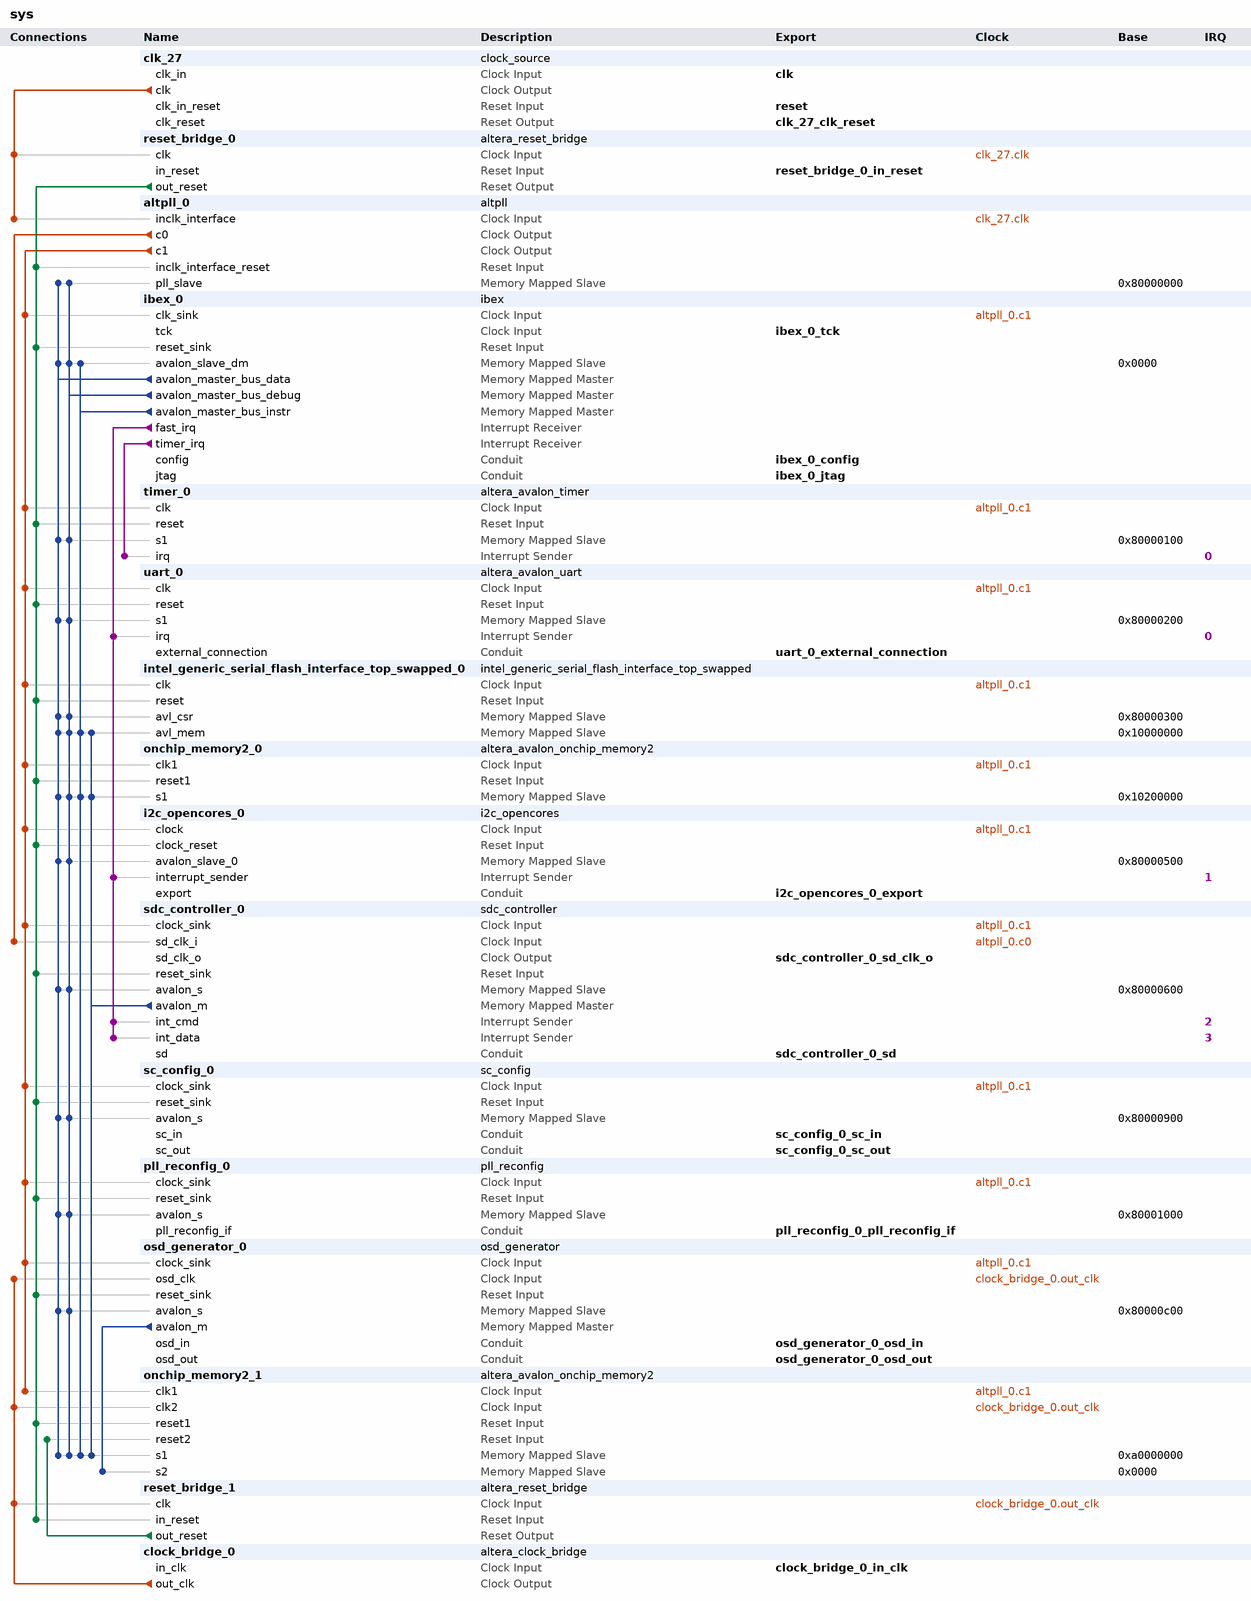
[diagram p0: system contents]
# Platform Designer (Qsys) system sys, Cyclone IV E EP4CE15E22C8
# Parameters at their usual value, and those the tool derives, are not listed.
package require -exact qsys 24.1
create_system sys
set_project_property DEVICE_FAMILY {Cyclone IV E}
set_project_property DEVICE EP4CE15E22C8

add_instance clk_27 clock_source 24.1
set_instance_parameter_value clk_27 clockFrequency 27000000

add_instance reset_bridge_0 altera_reset_bridge 24.1
set_instance_parameter_value reset_bridge_0 ACTIVE_LOW_RESET 1
set_instance_parameter_value reset_bridge_0 SYNCHRONOUS_EDGES deassert

add_instance altpll_0 altpll 24.1
set_instance_parameter_value altpll_0 CLK0_DIVIDE_BY 1
set_instance_parameter_value altpll_0 CLK0_MULTIPLY_BY 4
set_instance_parameter_value altpll_0 CLK1_DIVIDE_BY 1
set_instance_parameter_value altpll_0 CLK1_DUTY_CYCLE 50
set_instance_parameter_value altpll_0 CLK1_MULTIPLY_BY 2
set_instance_parameter_value altpll_0 CLK1_PHASE_SHIFT 0
set_instance_parameter_value altpll_0 INCLK0_INPUT_FREQUENCY 37037
set_instance_parameter_value altpll_0 PORT_ARESET PORT_UNUSED
set_instance_parameter_value altpll_0 PORT_LOCKED PORT_UNUSED
set_instance_parameter_value altpll_0 PORT_clk1 PORT_USED
set_instance_parameter_value altpll_0 PORT_clk2 PORT_UNUSED
set_instance_parameter_value altpll_0 PORT_clk3 PORT_UNUSED

add_instance ibex_0 ibex 1.0
set_instance_parameter_value ibex_0 IBEX_RV32E true

add_instance timer_0 altera_avalon_timer 24.1
set_instance_parameter_value timer_0 alwaysRun true
set_instance_parameter_value timer_0 fixedPeriod true
set_instance_parameter_value timer_0 period 5400
set_instance_parameter_value timer_0 periodUnits CLOCKS
set_instance_parameter_value timer_0 snapshot false

add_instance uart_0 altera_avalon_uart 24.1
set_instance_parameter_value uart_0 baud 115200
set_instance_parameter_value uart_0 dataBits 8
set_instance_parameter_value uart_0 fixedBaud true
set_instance_parameter_value uart_0 parity NONE
set_instance_parameter_value uart_0 stopBits 1

add_instance intel_generic_serial_flash_interface_top_swapped_0 intel_generic_serial_flash_interface_top_swapped 24.1
set_instance_parameter_value intel_generic_serial_flash_interface_top_swapped_0 CHIP_SELECT_BYPASS false
set_instance_parameter_value intel_generic_serial_flash_interface_top_swapped_0 CHIP_SELS 1
set_instance_parameter_value intel_generic_serial_flash_interface_top_swapped_0 DEBUG_OPTION 0
set_instance_parameter_value intel_generic_serial_flash_interface_top_swapped_0 DEFAULT_VALUE_REG_0 1
set_instance_parameter_value intel_generic_serial_flash_interface_top_swapped_0 DEFAULT_VALUE_REG_1 1
set_instance_parameter_value intel_generic_serial_flash_interface_top_swapped_0 DEFAULT_VALUE_REG_2 0
set_instance_parameter_value intel_generic_serial_flash_interface_top_swapped_0 DEFAULT_VALUE_REG_3 0
set_instance_parameter_value intel_generic_serial_flash_interface_top_swapped_0 DEFAULT_VALUE_REG_4 0
set_instance_parameter_value intel_generic_serial_flash_interface_top_swapped_0 DEFAULT_VALUE_REG_5 3
set_instance_parameter_value intel_generic_serial_flash_interface_top_swapped_0 DEFAULT_VALUE_REG_6 1282
set_instance_parameter_value intel_generic_serial_flash_interface_top_swapped_0 DEFAULT_VALUE_REG_7 6149
set_instance_parameter_value intel_generic_serial_flash_interface_top_swapped_0 DEVICE_DENSITY 16
set_instance_parameter_value intel_generic_serial_flash_interface_top_swapped_0 ENABLE_SIM_MODEL false
set_instance_parameter_value intel_generic_serial_flash_interface_top_swapped_0 PIPE_CMD_GEN_CMD 0
set_instance_parameter_value intel_generic_serial_flash_interface_top_swapped_0 PIPE_CSR 0
set_instance_parameter_value intel_generic_serial_flash_interface_top_swapped_0 PIPE_MUX_CMD 0
set_instance_parameter_value intel_generic_serial_flash_interface_top_swapped_0 PIPE_XIP 0
set_instance_parameter_value intel_generic_serial_flash_interface_top_swapped_0 USE_CHIP_SEL_FROM_CSR 1
set_instance_parameter_value intel_generic_serial_flash_interface_top_swapped_0 gui_use_asmiblock false
set_instance_parameter_value intel_generic_serial_flash_interface_top_swapped_0 gui_use_csr_byteenable false
set_instance_parameter_value intel_generic_serial_flash_interface_top_swapped_0 gui_use_gpio false

add_instance onchip_memory2_0 altera_avalon_onchip_memory2 24.1
set_instance_parameter_value onchip_memory2_0 dataWidth 32
set_instance_parameter_value onchip_memory2_0 dualPort false
set_instance_parameter_value onchip_memory2_0 initMemContent false
set_instance_parameter_value onchip_memory2_0 initializationFileName onchip_mem.hex
set_instance_parameter_value onchip_memory2_0 memorySize 16384
set_instance_parameter_value onchip_memory2_0 readDuringWriteMode OLD_DATA
set_instance_parameter_value onchip_memory2_0 singleClockOperation true

add_instance i2c_opencores_0 i2c_opencores 17.1
set_instance_parameter_value i2c_opencores_0 dedicated_spi 0

add_instance sdc_controller_0 sdc_controller 1.0

add_instance sc_config_0 sc_config 1.0

add_instance pll_reconfig_0 pll_reconfig 1.0

add_instance osd_generator_0 osd_generator 1.0

add_instance onchip_memory2_1 altera_avalon_onchip_memory2 24.1
set_instance_parameter_value onchip_memory2_1 dataWidth 32
set_instance_parameter_value onchip_memory2_1 dualPort true
set_instance_parameter_value onchip_memory2_1 initMemContent false
set_instance_parameter_value onchip_memory2_1 initializationFileName onchip_mem.hex
set_instance_parameter_value onchip_memory2_1 memorySize 24576

add_instance reset_bridge_1 altera_reset_bridge 24.1
set_instance_parameter_value reset_bridge_1 ACTIVE_LOW_RESET 0
set_instance_parameter_value reset_bridge_1 SYNCHRONOUS_EDGES deassert

add_instance clock_bridge_0 altera_clock_bridge 24.1
set_instance_parameter_value clock_bridge_0 DERIVED_CLOCK_RATE 0
set_instance_parameter_value clock_bridge_0 EXPLICIT_CLOCK_RATE 0

# connections
add_connection altpll_0.c0 sdc_controller_0.sd_clk_i clock
add_connection altpll_0.c1 i2c_opencores_0.clock clock
add_connection altpll_0.c1 ibex_0.clk_sink clock
add_connection altpll_0.c1 intel_generic_serial_flash_interface_top_swapped_0.clk clock
add_connection altpll_0.c1 onchip_memory2_0.clk1 clock
add_connection altpll_0.c1 onchip_memory2_1.clk1 clock
add_connection altpll_0.c1 osd_generator_0.clock_sink clock
add_connection altpll_0.c1 pll_reconfig_0.clock_sink clock
add_connection altpll_0.c1 sc_config_0.clock_sink clock
add_connection altpll_0.c1 sdc_controller_0.clock_sink clock
add_connection altpll_0.c1 timer_0.clk clock
add_connection altpll_0.c1 uart_0.clk clock
add_connection clk_27.clk altpll_0.inclk_interface clock
add_connection clk_27.clk reset_bridge_0.clk clock
add_connection clock_bridge_0.out_clk onchip_memory2_1.clk2 clock
add_connection clock_bridge_0.out_clk osd_generator_0.osd_clk clock
add_connection clock_bridge_0.out_clk reset_bridge_1.clk clock
add_connection reset_bridge_0.out_reset altpll_0.inclk_interface_reset reset
add_connection reset_bridge_0.out_reset i2c_opencores_0.clock_reset reset
add_connection reset_bridge_0.out_reset ibex_0.reset_sink reset
add_connection reset_bridge_0.out_reset intel_generic_serial_flash_interface_top_swapped_0.reset reset
add_connection reset_bridge_0.out_reset onchip_memory2_0.reset1 reset
add_connection reset_bridge_0.out_reset onchip_memory2_1.reset1 reset
add_connection reset_bridge_0.out_reset osd_generator_0.reset_sink reset
add_connection reset_bridge_0.out_reset pll_reconfig_0.reset_sink reset
add_connection reset_bridge_0.out_reset reset_bridge_1.in_reset reset
add_connection reset_bridge_0.out_reset sc_config_0.reset_sink reset
add_connection reset_bridge_0.out_reset sdc_controller_0.reset_sink reset
add_connection reset_bridge_0.out_reset timer_0.reset reset
add_connection reset_bridge_0.out_reset uart_0.reset reset
add_connection reset_bridge_1.out_reset onchip_memory2_1.reset2 reset
add_connection ibex_0.avalon_master_bus_data altpll_0.pll_slave avalon
set_connection_parameter_value ibex_0.avalon_master_bus_data/altpll_0.pll_slave baseAddress 0x80000000
add_connection ibex_0.avalon_master_bus_data i2c_opencores_0.avalon_slave_0 avalon
set_connection_parameter_value ibex_0.avalon_master_bus_data/i2c_opencores_0.avalon_slave_0 baseAddress 0x80000500
add_connection ibex_0.avalon_master_bus_data ibex_0.avalon_slave_dm avalon
set_connection_parameter_value ibex_0.avalon_master_bus_data/ibex_0.avalon_slave_dm baseAddress 0x0000
add_connection ibex_0.avalon_master_bus_data intel_generic_serial_flash_interface_top_swapped_0.avl_csr avalon
set_connection_parameter_value ibex_0.avalon_master_bus_data/intel_generic_serial_flash_interface_top_swapped_0.avl_csr baseAddress 0x80000300
add_connection ibex_0.avalon_master_bus_data intel_generic_serial_flash_interface_top_swapped_0.avl_mem avalon
set_connection_parameter_value ibex_0.avalon_master_bus_data/intel_generic_serial_flash_interface_top_swapped_0.avl_mem baseAddress 0x10000000
add_connection ibex_0.avalon_master_bus_data onchip_memory2_0.s1 avalon
set_connection_parameter_value ibex_0.avalon_master_bus_data/onchip_memory2_0.s1 baseAddress 0x10200000
add_connection ibex_0.avalon_master_bus_data onchip_memory2_1.s1 avalon
set_connection_parameter_value ibex_0.avalon_master_bus_data/onchip_memory2_1.s1 baseAddress 0xa0000000
add_connection ibex_0.avalon_master_bus_data osd_generator_0.avalon_s avalon
set_connection_parameter_value ibex_0.avalon_master_bus_data/osd_generator_0.avalon_s baseAddress 0x80000c00
add_connection ibex_0.avalon_master_bus_data pll_reconfig_0.avalon_s avalon
set_connection_parameter_value ibex_0.avalon_master_bus_data/pll_reconfig_0.avalon_s baseAddress 0x80001000
add_connection ibex_0.avalon_master_bus_data sc_config_0.avalon_s avalon
set_connection_parameter_value ibex_0.avalon_master_bus_data/sc_config_0.avalon_s baseAddress 0x80000900
add_connection ibex_0.avalon_master_bus_data sdc_controller_0.avalon_s avalon
set_connection_parameter_value ibex_0.avalon_master_bus_data/sdc_controller_0.avalon_s baseAddress 0x80000600
add_connection ibex_0.avalon_master_bus_data timer_0.s1 avalon
set_connection_parameter_value ibex_0.avalon_master_bus_data/timer_0.s1 baseAddress 0x80000100
add_connection ibex_0.avalon_master_bus_data uart_0.s1 avalon
set_connection_parameter_value ibex_0.avalon_master_bus_data/uart_0.s1 baseAddress 0x80000200
add_connection ibex_0.avalon_master_bus_debug altpll_0.pll_slave avalon
set_connection_parameter_value ibex_0.avalon_master_bus_debug/altpll_0.pll_slave baseAddress 0x80000000
add_connection ibex_0.avalon_master_bus_debug i2c_opencores_0.avalon_slave_0 avalon
set_connection_parameter_value ibex_0.avalon_master_bus_debug/i2c_opencores_0.avalon_slave_0 baseAddress 0x80000500
add_connection ibex_0.avalon_master_bus_debug ibex_0.avalon_slave_dm avalon
set_connection_parameter_value ibex_0.avalon_master_bus_debug/ibex_0.avalon_slave_dm baseAddress 0x0000
add_connection ibex_0.avalon_master_bus_debug intel_generic_serial_flash_interface_top_swapped_0.avl_csr avalon
set_connection_parameter_value ibex_0.avalon_master_bus_debug/intel_generic_serial_flash_interface_top_swapped_0.avl_csr baseAddress 0x80000300
add_connection ibex_0.avalon_master_bus_debug intel_generic_serial_flash_interface_top_swapped_0.avl_mem avalon
set_connection_parameter_value ibex_0.avalon_master_bus_debug/intel_generic_serial_flash_interface_top_swapped_0.avl_mem baseAddress 0x10000000
add_connection ibex_0.avalon_master_bus_debug onchip_memory2_0.s1 avalon
set_connection_parameter_value ibex_0.avalon_master_bus_debug/onchip_memory2_0.s1 baseAddress 0x10200000
add_connection ibex_0.avalon_master_bus_debug onchip_memory2_1.s1 avalon
set_connection_parameter_value ibex_0.avalon_master_bus_debug/onchip_memory2_1.s1 baseAddress 0xa0000000
add_connection ibex_0.avalon_master_bus_debug osd_generator_0.avalon_s avalon
set_connection_parameter_value ibex_0.avalon_master_bus_debug/osd_generator_0.avalon_s baseAddress 0x80000c00
add_connection ibex_0.avalon_master_bus_debug pll_reconfig_0.avalon_s avalon
set_connection_parameter_value ibex_0.avalon_master_bus_debug/pll_reconfig_0.avalon_s baseAddress 0x80001000
add_connection ibex_0.avalon_master_bus_debug sc_config_0.avalon_s avalon
set_connection_parameter_value ibex_0.avalon_master_bus_debug/sc_config_0.avalon_s baseAddress 0x80000900
add_connection ibex_0.avalon_master_bus_debug sdc_controller_0.avalon_s avalon
set_connection_parameter_value ibex_0.avalon_master_bus_debug/sdc_controller_0.avalon_s baseAddress 0x80000600
add_connection ibex_0.avalon_master_bus_debug timer_0.s1 avalon
set_connection_parameter_value ibex_0.avalon_master_bus_debug/timer_0.s1 baseAddress 0x80000100
add_connection ibex_0.avalon_master_bus_debug uart_0.s1 avalon
set_connection_parameter_value ibex_0.avalon_master_bus_debug/uart_0.s1 baseAddress 0x80000200
add_connection ibex_0.avalon_master_bus_instr ibex_0.avalon_slave_dm avalon
set_connection_parameter_value ibex_0.avalon_master_bus_instr/ibex_0.avalon_slave_dm baseAddress 0x0000
add_connection ibex_0.avalon_master_bus_instr intel_generic_serial_flash_interface_top_swapped_0.avl_mem avalon
set_connection_parameter_value ibex_0.avalon_master_bus_instr/intel_generic_serial_flash_interface_top_swapped_0.avl_mem baseAddress 0x10000000
add_connection ibex_0.avalon_master_bus_instr onchip_memory2_0.s1 avalon
set_connection_parameter_value ibex_0.avalon_master_bus_instr/onchip_memory2_0.s1 baseAddress 0x10200000
add_connection ibex_0.avalon_master_bus_instr onchip_memory2_1.s1 avalon
set_connection_parameter_value ibex_0.avalon_master_bus_instr/onchip_memory2_1.s1 baseAddress 0xa0000000
add_connection osd_generator_0.avalon_m onchip_memory2_1.s2 avalon
set_connection_parameter_value osd_generator_0.avalon_m/onchip_memory2_1.s2 baseAddress 0x0000
add_connection sdc_controller_0.avalon_m intel_generic_serial_flash_interface_top_swapped_0.avl_mem avalon
set_connection_parameter_value sdc_controller_0.avalon_m/intel_generic_serial_flash_interface_top_swapped_0.avl_mem baseAddress 0x10000000
add_connection sdc_controller_0.avalon_m onchip_memory2_0.s1 avalon
set_connection_parameter_value sdc_controller_0.avalon_m/onchip_memory2_0.s1 baseAddress 0x10200000
add_connection sdc_controller_0.avalon_m onchip_memory2_1.s1 avalon
set_connection_parameter_value sdc_controller_0.avalon_m/onchip_memory2_1.s1 baseAddress 0xa0000000
add_connection ibex_0.fast_irq i2c_opencores_0.interrupt_sender interrupt
set_connection_parameter_value ibex_0.fast_irq/i2c_opencores_0.interrupt_sender irqNumber 1
add_connection ibex_0.fast_irq sdc_controller_0.int_cmd interrupt
set_connection_parameter_value ibex_0.fast_irq/sdc_controller_0.int_cmd irqNumber 2
add_connection ibex_0.fast_irq sdc_controller_0.int_data interrupt
set_connection_parameter_value ibex_0.fast_irq/sdc_controller_0.int_data irqNumber 3
add_connection ibex_0.fast_irq uart_0.irq interrupt
set_connection_parameter_value ibex_0.fast_irq/uart_0.irq irqNumber 0
add_connection ibex_0.timer_irq timer_0.irq interrupt
set_connection_parameter_value ibex_0.timer_irq/timer_0.irq irqNumber 0

# exported interfaces
add_interface clk clock sink
set_interface_property clk EXPORT_OF clk_27.clk_in
add_interface clk_27_clk_reset reset source
set_interface_property clk_27_clk_reset EXPORT_OF clk_27.clk_reset
add_interface clock_bridge_0_in_clk clock sink
set_interface_property clock_bridge_0_in_clk EXPORT_OF clock_bridge_0.in_clk
add_interface i2c_opencores_0_export conduit end
set_interface_property i2c_opencores_0_export EXPORT_OF i2c_opencores_0.export
add_interface ibex_0_config conduit end
set_interface_property ibex_0_config EXPORT_OF ibex_0.config
add_interface ibex_0_jtag conduit end
set_interface_property ibex_0_jtag EXPORT_OF ibex_0.jtag
add_interface ibex_0_tck clock sink
set_interface_property ibex_0_tck EXPORT_OF ibex_0.tck
add_interface osd_generator_0_osd_in conduit end
set_interface_property osd_generator_0_osd_in EXPORT_OF osd_generator_0.osd_in
add_interface osd_generator_0_osd_out conduit end
set_interface_property osd_generator_0_osd_out EXPORT_OF osd_generator_0.osd_out
add_interface pll_reconfig_0_pll_reconfig_if conduit end
set_interface_property pll_reconfig_0_pll_reconfig_if EXPORT_OF pll_reconfig_0.pll_reconfig_if
add_interface reset reset sink
set_interface_property reset EXPORT_OF clk_27.clk_in_reset
add_interface reset_bridge_0_in_reset reset sink
set_interface_property reset_bridge_0_in_reset EXPORT_OF reset_bridge_0.in_reset
add_interface sc_config_0_sc_in conduit end
set_interface_property sc_config_0_sc_in EXPORT_OF sc_config_0.sc_in
add_interface sc_config_0_sc_out conduit end
set_interface_property sc_config_0_sc_out EXPORT_OF sc_config_0.sc_out
add_interface sdc_controller_0_sd conduit end
set_interface_property sdc_controller_0_sd EXPORT_OF sdc_controller_0.sd
add_interface sdc_controller_0_sd_clk_o clock source
set_interface_property sdc_controller_0_sd_clk_o EXPORT_OF sdc_controller_0.sd_clk_o
add_interface uart_0_external_connection conduit end
set_interface_property uart_0_external_connection EXPORT_OF uart_0.external_connection

set_interconnect_requirement {$system} qsys_mm.clockCrossingAdapter HANDSHAKE
set_interconnect_requirement {$system} qsys_mm.insertDefaultSlave false
set_interconnect_requirement {$system} qsys_mm.maxAdditionalLatency 1

save_system sys.qsys
